# Altium schematic sheet CONNECTEUR_2.SchDoc: DARKYDEN_CONNECTEUR_2
size Letter; ApprovedBy: APPROUVÉ PAR; Author: Harold Malbrouck; Organization: Cegep Limoilou; Address1: 1300, 8e Avenue; Address2: Québec, QC; Address3: Canada; Address4: G1J 5L5; Revision: Rev.B; SheetNumber: 4; SheetTotal: 21
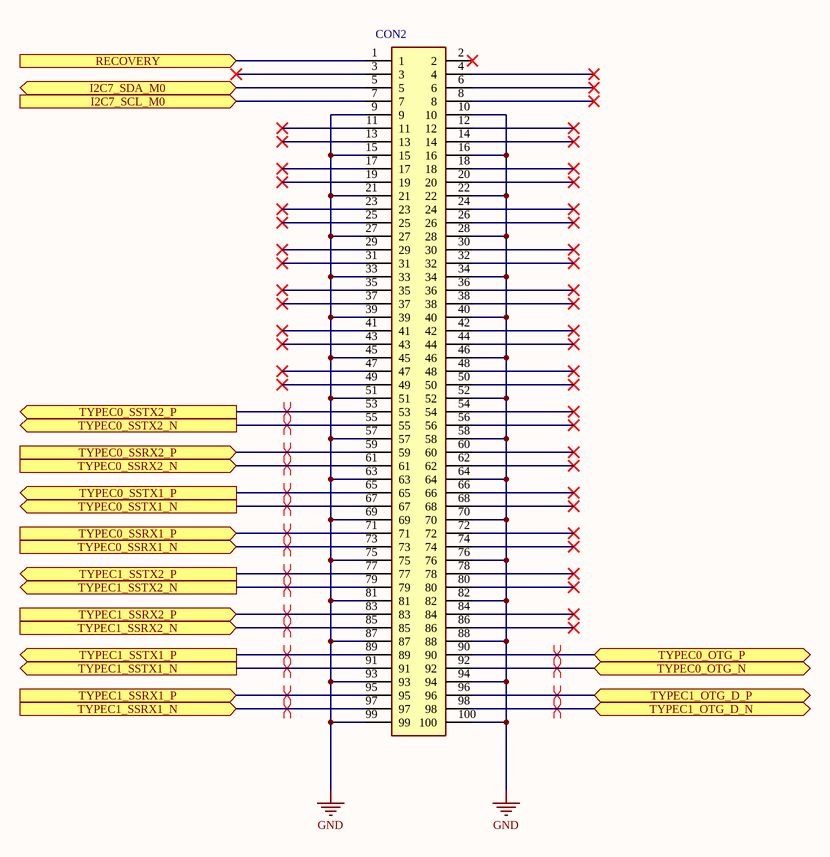
[diagram p0: CONNECTEUR_2.SchDoc]

## Parts
CON2  DF40HC  [DF40HC30100DS04V51_MOD]  (value not drawn)

## Ports
I2C7_SCL_M0 (in, see USBC_B[2D], USBC_B[3B]), I2C7_SDA_M0 (bidir, see USBC_B[3B], USBC_B[3D]), RECOVERY (in, see SystemCTL[1C]), TYPEC0_OTG_N (bidir, see USBC_A[2B]), TYPEC0_OTG_P (bidir, see USBC_A[2B]), TYPEC0_SSRX1_N (in, see USBC_A[1C], USBC_A[2B]), TYPEC0_SSRX1_P (in, see USBC_A[1C], USBC_A[2B]), TYPEC0_SSRX2_N (in, see USBC_A[2B], USBC_A[3C]), TYPEC0_SSRX2_P (in, see USBC_A[2B], USBC_A[3C]), TYPEC0_SSTX1_N (out, see USBC_A[2B], USBC_A[2C]), TYPEC0_SSTX1_P (out, see USBC_A[2B], USBC_A[2C]), TYPEC0_SSTX2_N (out, see USBC_A[2B], USBC_A[4C]), TYPEC0_SSTX2_P (out, see USBC_A[2B], USBC_A[4C]), TYPEC1_OTG_D_N (bidir, see USBC_B[2B]), TYPEC1_OTG_D_P (bidir, see USBC_B[2B]), TYPEC1_SSRX1_N (in, see USBC_B[1B], USBC_B[1C]), TYPEC1_SSRX1_P (in, see USBC_B[1B], USBC_B[1C]), TYPEC1_SSRX2_N (in, see USBC_B[1B], USBC_B[3C]), TYPEC1_SSRX2_P (in, see USBC_B[1B], USBC_B[3C]), TYPEC1_SSTX1_N (out, see USBC_B[1B], USBC_B[2C]), TYPEC1_SSTX1_P (out, see USBC_B[1B], USBC_B[2C]), TYPEC1_SSTX2_N (out, see USBC_B[1B], USBC_B[4C]), TYPEC1_SSTX2_P (out, see USBC_B[1B], USBC_B[4C])

## Nets
GND: CON2.9 CON2.10 CON2.15 CON2.16 CON2.21 CON2.22 CON2.27 CON2.28 CON2.33 CON2.34 CON2.39 CON2.40 CON2.45 CON2.46 CON2.51 CON2.52 CON2.57 CON2.58 CON2.63 CON2.64 CON2.69 CON2.70 CON2.75 CON2.76 CON2.81 CON2.82 CON2.87 CON2.88 CON2.93 CON2.94 CON2.99 CON2.100
I2C7_SCL_M0: CON2.7 ; port I2C7_SCL_M0
I2C7_SDA_M0: CON2.5 ; port I2C7_SDA_M0
RECOVERY: CON2.1 ; port RECOVERY
TYPEC0_OTG_N: CON2.92 ; port TYPEC0_OTG_N
TYPEC0_OTG_P: CON2.90 ; port TYPEC0_OTG_P
TYPEC0_SSRX1_N: CON2.73 ; port TYPEC0_SSRX1_N
TYPEC0_SSRX1_P: CON2.71 ; port TYPEC0_SSRX1_P
TYPEC0_SSRX2_N: CON2.61 ; port TYPEC0_SSRX2_N
TYPEC0_SSRX2_P: CON2.59 ; port TYPEC0_SSRX2_P
TYPEC0_SSTX1_N: CON2.67 ; port TYPEC0_SSTX1_N
TYPEC0_SSTX1_P: CON2.65 ; port TYPEC0_SSTX1_P
TYPEC0_SSTX2_N: CON2.55 ; port TYPEC0_SSTX2_N
TYPEC0_SSTX2_P: CON2.53 ; port TYPEC0_SSTX2_P
TYPEC1_OTG_D_N: CON2.98 ; port TYPEC1_OTG_D_N
TYPEC1_OTG_D_P: CON2.96 ; port TYPEC1_OTG_D_P
TYPEC1_SSRX1_N: CON2.97 ; port TYPEC1_SSRX1_N
TYPEC1_SSRX1_P: CON2.95 ; port TYPEC1_SSRX1_P
TYPEC1_SSRX2_N: CON2.85 ; port TYPEC1_SSRX2_N
TYPEC1_SSRX2_P: CON2.83 ; port TYPEC1_SSRX2_P
TYPEC1_SSTX1_N: CON2.91 ; port TYPEC1_SSTX1_N
TYPEC1_SSTX1_P: CON2.89 ; port TYPEC1_SSTX1_P
TYPEC1_SSTX2_N: CON2.79 ; port TYPEC1_SSTX2_N
TYPEC1_SSTX2_P: CON2.77 ; port TYPEC1_SSTX2_P

Not connected (* = marked no-connect by the designer): CON2 2* 3* 4* 6* 8* 11* 12* 13* 14* 17* 18* 19* 20* 23* 24* 25* 26* 29* 30* 31* 32* 35* 36* 37* 38* 41* 42* 43* 44* 47* 48* 49* 50* 54* 56* 60* 62* 66* 68* 72* 74* 78* 80* 84* 86*

## Layout directives
differential pair: TYPEC0_OTG_N, TYPEC0_OTG_P, TYPEC0_SSRX1_N, TYPEC0_SSRX1_P, TYPEC0_SSRX2_N, TYPEC0_SSRX2_P, TYPEC0_SSTX1_N, TYPEC0_SSTX1_P, TYPEC0_SSTX2_N, TYPEC0_SSTX2_P, TYPEC1_OTG_D_N, TYPEC1_OTG_D_P, TYPEC1_SSRX1_N, TYPEC1_SSRX1_P, TYPEC1_SSRX2_N, TYPEC1_SSRX2_P, TYPEC1_SSTX1_N, TYPEC1_SSTX1_P, TYPEC1_SSTX2_N, TYPEC1_SSTX2_P

## Notes on the sheet
- Titre :
- Conception :
- Date :
- Approbation :
- Heure :
- Révision :
- Feuille
- de
- Fichier :

## Library data of the parts
CON2 = DF40HC(3.0)-100DS-0.4V(51): Stacking Board Connector, DF40 Series, Receptacle, 0.4 mm, 100, Surface Mount, G; Manufacturer_Name: Hirose; Number of Positions: 100; Contact Resistance: 90mR; Contact Voltage Rating (AC): 30V; Current Rating: 300mA; Mated Stacking Heights: 3mm; Contact Pitch: 400um; Datasheet Link: https://componentsearchengine.com/Datasheets/1/DF40HC(3.0)-100DS-0.4V(51.pdf; Height: 3.05mm; Mouser Part Number: 798-DF40HC30100DS451; Mouser Price/Stock: https://www.mouser.co.uk/ProductDetail/Hirose-Connector/DF40HC3.0-100DS-0.4V51?qs=%252BAZVS4b%2FkgIV%252B3vHYy2dCA%3D%3D; Arrow Part Number: DF40HC(3.0)-100DS-0.4V(51; Arrow Price/Stock: https://www.arrow.com/en/products/df40hc-3.0-100ds-0.4v-51/hirose-electric; Supplier: Digikey; Supplier Part Number: 26-DF40HC(3.0)-100DS-0.4V(51)CT-ND; Manufacturer: Hirose; Manufacturer Part Number: DF40HC(3.0)-100DS-0.4V(51; RoHS: Yes; Category: Headers and Wire Housings; Stock: 5604; Pricing: 1=2.61, 10=2.219, 25=2.0796, 50=1.9804, 100=1.8858, 250=1.76764, 500=1.68326, 1000=1.6524 (USD); Mounting Technology: Surface Mount; Contact Plating: Gold; Contact Material: Nickel,Gold; Housing Color: Black; Min Operating Temperature: -35°C; Max Operating Temperature: 85°C; Package Quantity: 3000; Packaging: Tape and Reel; Number of Rows: 2; Connector Type: Receptacle; Series: DF40; Contact Voltage Rating (DC): 30V; Number of Contacts: 100; Orientation: Straight; Voltage Rating: 30V; Length: 22.6mm; Width: 3.38mm; ComponentLink1URL: https://datasheet.ciiva.com/13559/ed-df40-20140305-13559540.pdf?src-supplier=Mouser; ComponentLink1Description: https://datasheet.ciiva.com/13559/ed-df40-20140305-13559540.pdf?src-supplier=Mouser